# EAGLE schematic CapstoneREV_10-5-25_3 (EAGLE 9.5.0)
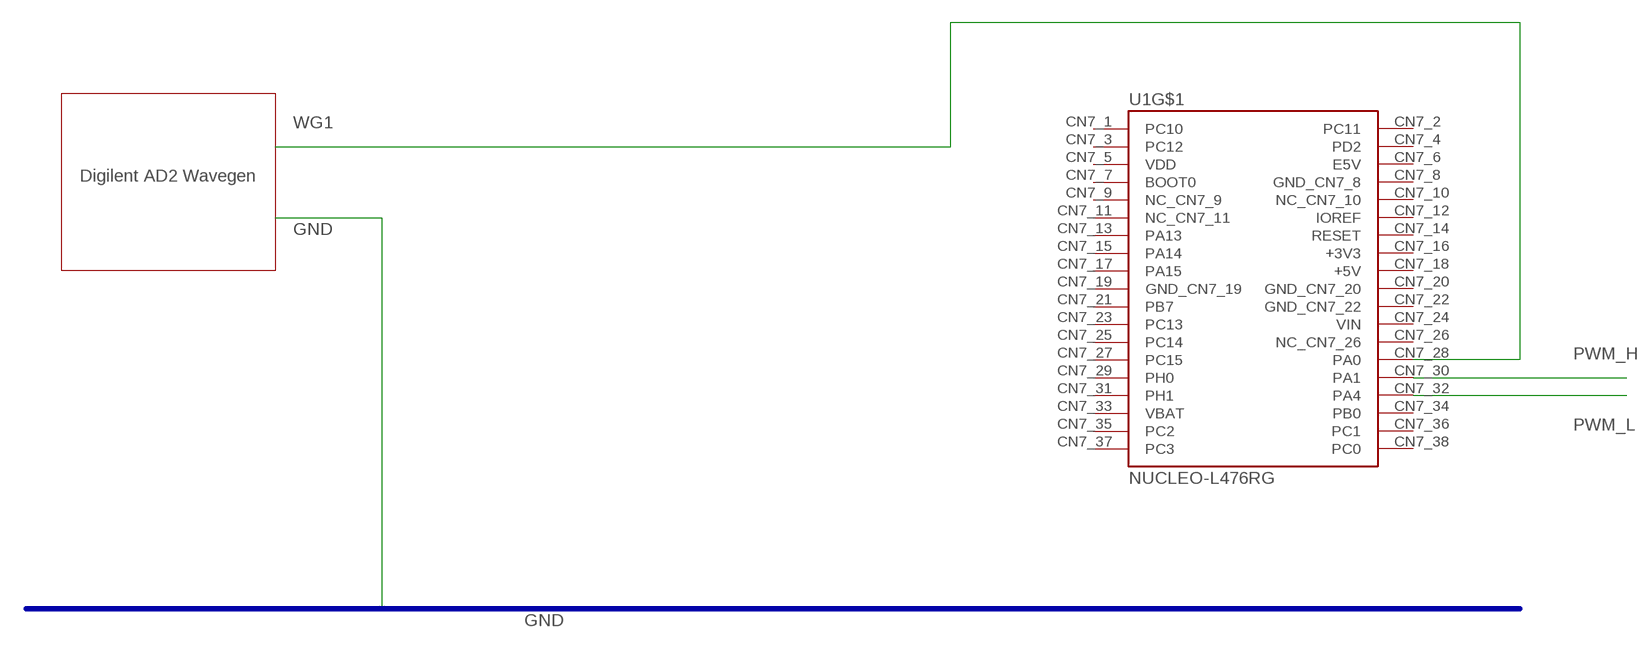
[diagram p0: schematic, sheet 1, part 1 of 2]
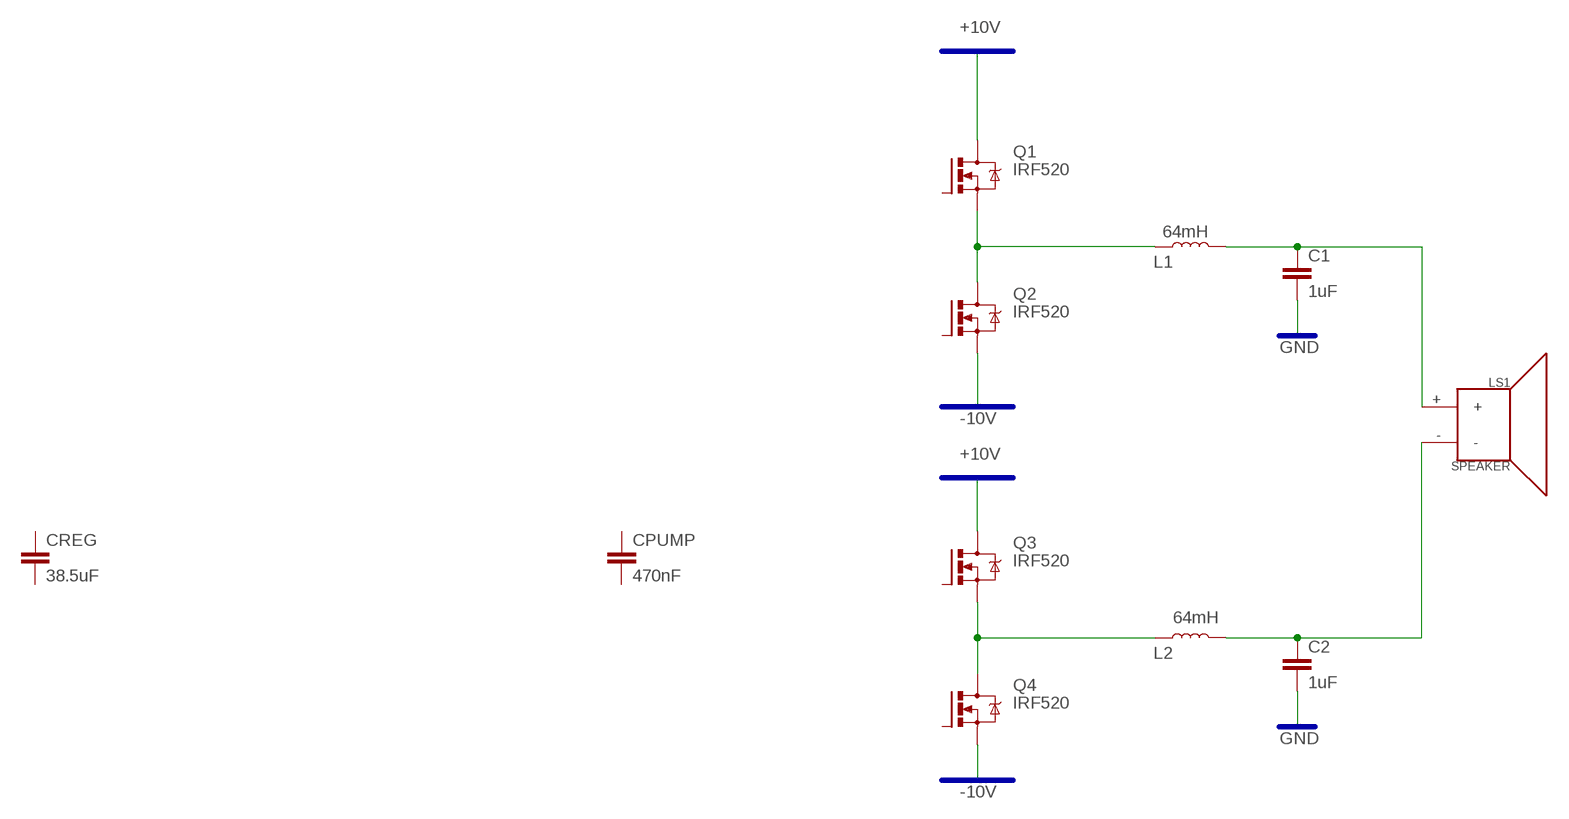
[diagram p1: schematic, sheet 1, part 2 of 2]

## Parts
C1  1uF  4.7NF-50V-10%(0603)  [0603]
C2  1uF  4.7NF-50V-10%(0603)  [0603]
CPUMP  470nF  4.7NF-50V-10%(0603)  [0603]
CREG  38.5uF  4.7NF-50V-10%(0603)  [0603]
L1  64mH  1.5UH-2X2-1.4A  [INDUCTOR_2X2]
L2  64mH  1.5UH-2X2-1.4A  [INDUCTOR_2X2]
LS1  SPEAKER  [PCB_MOUNT_SPEAKER]
Q1  IRF520  [TO220BV]
Q2  IRF520  [TO220BV]
Q3  IRF520  [TO220BV]
Q4  IRF520  [TO220BV]
U1  NUCLEO-L476RG  [MODULE_NUCLEO-L476RG]

## Nets
-10V: Q2.S
GND: C1.2 C2.2
N$1: L2.P$1 Q3.S Q4.D
N$2: Q4.S
N$3: Q3.D
N$4: U1.CN7_28(PA0)
N$5: L1.P$1 Q1.S Q2.D
N$6: Q1.D
N$7: C2.1 L2.P$2 LS1.-
N$8: C1.1 L1.P$2 LS1.+
PWM_H: U1.CN7_30(PA1)
PWM_L: U1.CN7_32(PA4)
Unconnected: CPUMP.1 CPUMP.2 CREG.1 CREG.2 Q1.G Q2.G Q3.G Q4.G U1.CN7_1(PC10) U1.CN7_2(PC11) U1.CN7_3(PC12) U1.CN7_4(PD2) U1.CN7_7(BOOT0) U1.CN7_9(NC_CN7_9) U1.CN7_10(NC_CN7_10) U1.CN7_11(NC_CN7_11) U1.CN7_12(IOREF) U1.CN7_13(PA13) U1.CN7_14(RESET) U1.CN7_15(PA14) U1.CN7_17(PA15) U1.CN7_21(PB7) U1.CN7_23(PC13) U1.CN7_25(PC14) U1.CN7_26(NC_CN7_26) U1.CN7_27(PC15) U1.CN7_29(PH0) U1.CN7_31(PH1) U1.CN7_34(PB0) U1.CN7_35(PC2) U1.CN7_36(PC1) U1.CN7_37(PC3) U1.CN7_38(PC0) U1.CN10_1(PC9) U1.CN10_2(PC8) U1.CN10_3(PB8) U1.CN10_4(PC6) U1.CN10_5(PB9) U1.CN10_6(PC5) U1.CN10_10(NC_CN10_10) U1.CN10_11(PA5) U1.CN10_12(PA12) U1.CN10_13(PA6) U1.CN10_14(PA11) U1.CN10_15(PA7) U1.CN10_16(PB12) U1.CN10_17(PB6) U1.CN10_18(PB11) U1.CN10_19(PC7) U1.CN10_21(PA9) U1.CN10_22(PB2) U1.CN10_23(PA8) U1.CN10_24(PB1) U1.CN10_25(PB10) U1.CN10_26(PB15) U1.CN10_27(PB4) U1.CN10_28(PB14) U1.CN10_29(PB5) U1.CN10_30(PB13) U1.CN10_31(PB3) U1.CN10_33(PA10) U1.CN10_34(PC4) U1.CN10_35(PA2) U1.CN10_36(NC_CN10_36) U1.CN10_37(PA3) U1.CN10_38(NC_CN10_38)

## Buses
+10V
-10V
GND

## Notes on the sheet
- WG1
- Digilent AD2 Wavegen

## Power pins joined to a net without a drawn wire
+3V3: U1.CN7_16(+3V3)
+5V: U1.CN7_18(+5V)
AGND: U1.CN10_32(AGND)
AVDD: U1.CN10_7(AVDD)
E5V: U1.CN7_6(E5V)
GND_CN7_8: U1.CN7_8(GND_CN7_8)
GND_CN7_19: U1.CN7_19(GND_CN7_19)
GND_CN7_20: U1.CN7_20(GND_CN7_20)
GND_CN7_22: U1.CN7_22(GND_CN7_22)
GND_CN10_9: U1.CN10_9(GND_CN10_9)
GND_CN10_20: U1.CN10_20(GND_CN10_20)
U5V: U1.CN10_8(U5V)
VBAT: U1.CN7_33(VBAT)
VDD: U1.CN7_5(VDD)
VIN: U1.CN7_24(VIN)

## Library data of the parts
C1 C2 CPUMP CREG = SparkFun-Retired:4.7NF-50V-10%(0603): CAP-11378; PROD_ID: CAP-11378; VALUE: 4.7nF
L1 L2 = SparkFun-Coils:1.5UH: FIXED IND 1.5UH 1.4A 120 MOHM; PROD_ID: NDUC-15405; VALUE: 1.5uH
LS1 = SparkFun-Electromechanical:SPEAKER: Speaker Generic 2-terminal loudspeakers SparkFun Products Speaker - PCB Mount <https://www.sparkfun.com/products/11089> (COM-11089); PROD_ID: COMP-11789; SF_SKU: COM-11089
Q1-Q4 = transistor-power:IRF520: HEXFET Power MOSFET
U1 = NUCLEO-L476RG:NUCLEO-L476RG; MANUFACTURER: STmicroelectronics; PARTREV: 15; STANDARD: Manufacturer Recommendations